# Altium schematic sheet Sheet2.SchDoc
size 431 x 279 mm; Organization: ORGANIZATION; Address1: ADDRESS 1; Address2: ADDRESS 2; Address3: ADDRESS 3; Address4: ADDRESS 4; Revision: -; SheetNumber: 2; SheetTotal: 2; ENG_APP_DATE: --/--/--; DSN_APP_DATE: --/--/--; CHK_APP_DATE: --/--/--
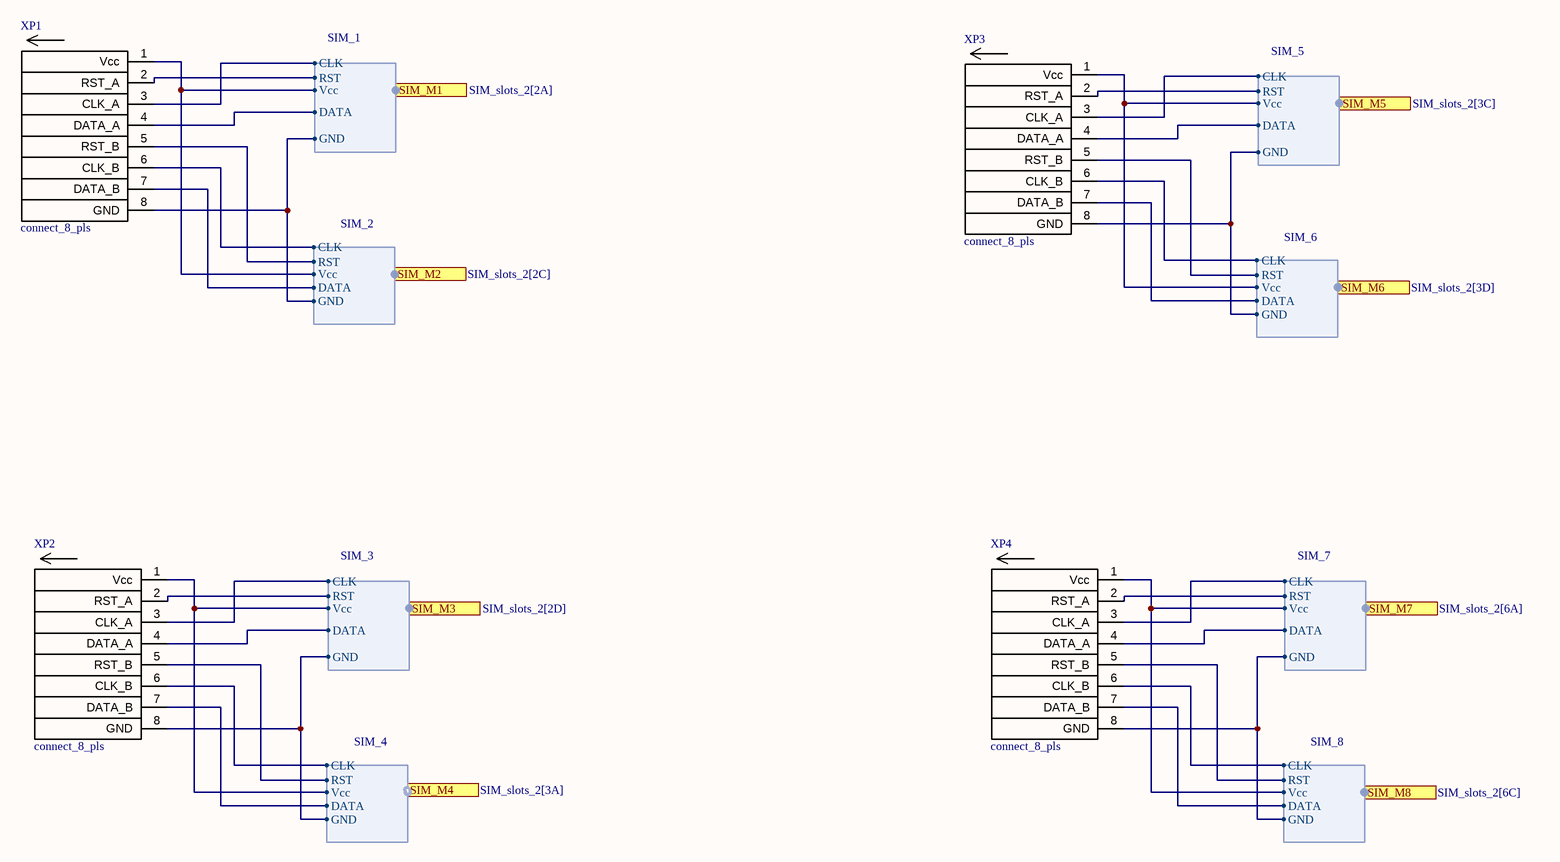
[diagram p0: Sheet2.SchDoc]

## Parts
XP1  connect_8_pls  [PLS-8]
XP2  connect_8_pls  [PLS-8]
XP3  connect_8_pls  [PLS-8]
XP4  connect_8_pls  [PLS-8]

## Ports
SIM_M1 (harness SIM_1, see SIM_slots_2[2A]), SIM_M2 (harness SIM_2, see SIM_slots_2[2C]), SIM_M3 (harness SIM_3, see SIM_slots_2[2D]), SIM_M4 (harness SIM_4, see SIM_slots_2[3A]), SIM_M5 (harness SIM_5, see SIM_slots_2[3C]), SIM_M6 (harness SIM_6, see SIM_slots_2[3D]), SIM_M7 (harness SIM_7, see SIM_slots_2[6A]), SIM_M8 (harness SIM_8, see SIM_slots_2[6C])

## Harnesses
SIM_1: CLK, RST, Vcc, DATA, GND
SIM_2: CLK, RST, Vcc, DATA, GND
SIM_3: CLK, RST, Vcc, DATA, GND
SIM_4: CLK, RST, Vcc, DATA, GND
SIM_5: CLK, RST, Vcc, DATA, GND
SIM_6: CLK, RST, Vcc, DATA, GND
SIM_7: CLK, RST, Vcc, DATA, GND
SIM_8: CLK, RST, Vcc, DATA, GND

## Nets
NetXP1_1: XP1.1(Vcc) ; port SIM_M1.Vcc, port SIM_M2.Vcc
NetXP1_2: XP1.2(RST_A) ; port SIM_M1.RST
NetXP1_3: XP1.3(CLK_A) ; port SIM_M1.CLK
NetXP1_4: XP1.4(DATA_A) ; port SIM_M1.DATA
NetXP1_5: XP1.5(RST_B) ; port SIM_M2.RST
NetXP1_6: XP1.6(CLK_B) ; port SIM_M2.CLK
NetXP1_7: XP1.7(DATA_B) ; port SIM_M2.DATA
NetXP1_8: XP1.8(GND) ; port SIM_M1.GND, port SIM_M2.GND
NetXP2_1: XP2.1(Vcc) ; port SIM_M3.Vcc, port SIM_M4.Vcc
NetXP2_2: XP2.2(RST_A) ; port SIM_M3.RST
NetXP2_3: XP2.3(CLK_A) ; port SIM_M3.CLK
NetXP2_4: XP2.4(DATA_A) ; port SIM_M3.DATA
NetXP2_5: XP2.5(RST_B) ; port SIM_M4.RST
NetXP2_6: XP2.6(CLK_B) ; port SIM_M4.CLK
NetXP2_7: XP2.7(DATA_B) ; port SIM_M4.DATA
NetXP2_8: XP2.8(GND) ; port SIM_M3.GND, port SIM_M4.GND
NetXP3_1: XP3.1(Vcc) ; port SIM_M5.Vcc, port SIM_M6.Vcc
NetXP3_2: XP3.2(RST_A) ; port SIM_M5.RST
NetXP3_3: XP3.3(CLK_A) ; port SIM_M5.CLK
NetXP3_4: XP3.4(DATA_A) ; port SIM_M5.DATA
NetXP3_5: XP3.5(RST_B) ; port SIM_M6.RST
NetXP3_6: XP3.6(CLK_B) ; port SIM_M6.CLK
NetXP3_7: XP3.7(DATA_B) ; port SIM_M6.DATA
NetXP3_8: XP3.8(GND) ; port SIM_M5.GND, port SIM_M6.GND
NetXP4_1: XP4.1(Vcc) ; port SIM_M7.Vcc, port SIM_M8.Vcc
NetXP4_2: XP4.2(RST_A) ; port SIM_M7.RST
NetXP4_3: XP4.3(CLK_A) ; port SIM_M7.CLK
NetXP4_4: XP4.4(DATA_A) ; port SIM_M7.DATA
NetXP4_5: XP4.5(RST_B) ; port SIM_M8.RST
NetXP4_6: XP4.6(CLK_B) ; port SIM_M8.CLK
NetXP4_7: XP4.7(DATA_B) ; port SIM_M8.DATA
NetXP4_8: XP4.8(GND) ; port SIM_M7.GND, port SIM_M8.GND

## Notes on the sheet
- DWG. NO.
- REV.
- SHT.
- THIS DOCUMENT AND THE DATA DISCLOSED HEREIN OR HEREWITH IS THE PROPERTY OF ALTIUM LIMITED AND MAY BE FREELY DISTRIBUTED IN WHOLE. NO RIGHTS ARE RESERVED OR EXPRESS OR IMPLIED WARANTEE GIVEN.
- REVISION
- DESCRIPTION
- DATE
- APPROVED
- ENG:
- APPROVALS
- PROJECT
- DSN:
- CHK:
- REFERENCE DOCUMENTS
- PROJECT REVISION:
- TITLE
- DOCUMENT REVISION:
- DESIGN ITEM:
- BOM:
- FAB DWG:
- PCB DWG:
- ASSY DWG:
- SCALE:
- SIZE
- B
- CAGE CODE
- FILE NAME
- DWG NO.
- SHEET
- OF
- REV

## Library data of the parts
XP1-XP4 = connect_8_pls: PLS-8 (DS1021-1x8); ManufacturerName: Connfly; System: Connector; Assembly: PLS-8 (DS1021-1x8); PartNumber: PLS-8 (DS1021-1x8)